# EAGLE design AmbaSat-01-SHT3x-DIS (EAGLE 9.5.1)
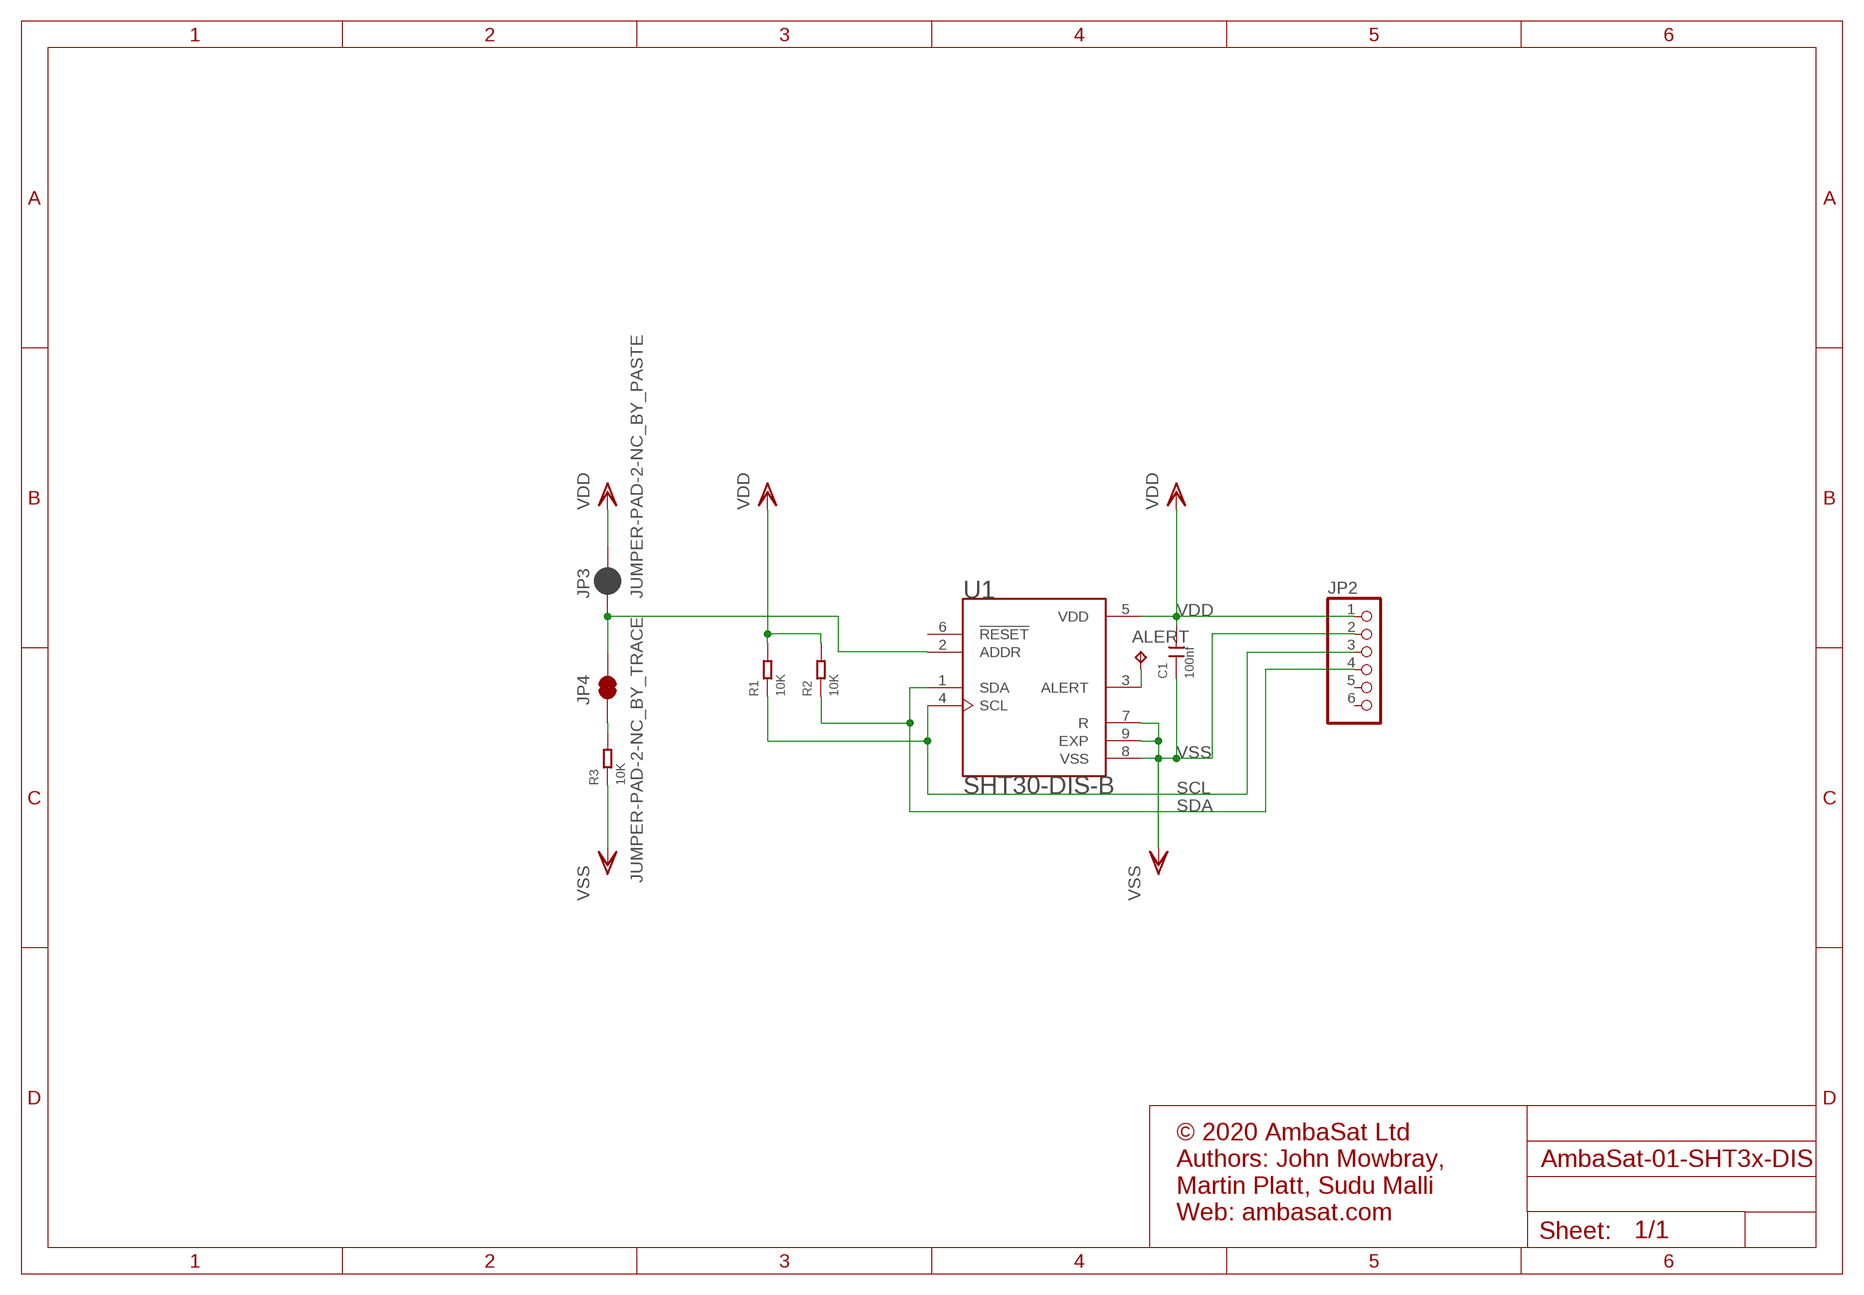
[diagram p0: schematic, sheet 1]

## Parts
ALERT  TPTP06R  [TP06R]
C1  100nf  CERAMIC-100NF-50V-10%-X7R(0603)  [C0603]
JP2  HEADER-1X6  [1X06_OVAL]
JP3  JUMPER-PAD-2-NC_BY_PASTE  [PAD-JUMPER-2-NC_BY_PASTE_YES_SILK]
JP4  JUMPER-PAD-2-NC_BY_TRACE  [PAD-JUMPER-2-NC_BY_TRACE_YES_SILK]
R1  10K  SMD-RES-10K-1%-1/10W(0603)  [R0603]
R2  10K  SMD-RES-10K-1%-1/10W(0603)  [R0603]
R3  10K  SMD-RES-10K-1%-1/10W(0603)  [R0603]
U1  SHT30-DIS-B  [DFN250X250X100-9N]

## Nets
N$1: JP3.1 JP4.2 U1.2(ADDR)
N$2: ALERT.TP U1.3(ALERT)
N$3: JP4.1 R3.2
SCL: JP2.3 R1.1 U1.4(SCL)
SDA: JP2.4 R2.1 U1.1(SDA)
VDD: C1.2 JP2.1 JP3.2 R1.2 R2.2 U1.5(VDD)
VSS: C1.1 JP2.2 R3.1 U1.7(R) U1.8(VSS) U1.9(EXP)
Unconnected: JP2.5 JP2.6 U1.6(!RESET)

## Notes on the sheet
- © 2020 AmbaSat Ltd
  Authors: John Mowbray, 
  Martin Platt, Sudu Malli
  Web: ambasat.com

## Library data of the parts
ALERT = testpad:TP: Test pad
C1 = Seeed-Capacitor:CERAMIC-100NF-50V-10%-X7R(0603): 302010138; MPN: CC0603KRX7R9BB104
JP2 = microbuilder:HEADER-1X6: PIN HEADER
JP3 = SparkFun-Passives:JUMPER-PAD-2-NC_BY_PASTE
JP4 = SparkFun-Passives:JUMPER-PAD-2-NC_BY_TRACE
R1-R3 = Seeed-Resistor:SMD-RES-10K-1%-1/10W(0603): 301010299; MPN: RC0603FR-0710KL
U1 = SHT30-DIS-B:SHT30-DIS-B: SHT3x Series 5.5 V ±3 %RH 0 to 100% Temperature and Humidity Sensor - DFN-8; AVAILABILITY: Unavailable; DESCRIPTION: SHT3x Series 5.5 V ±3 %RH 0 to 100% Temperature and Humidity Sensor - DFN-8; MF: Sensirion AG; MP: SHT30-DIS-B; PACKAGE: DFN-8 Sensirion; PRICE: None

## Board
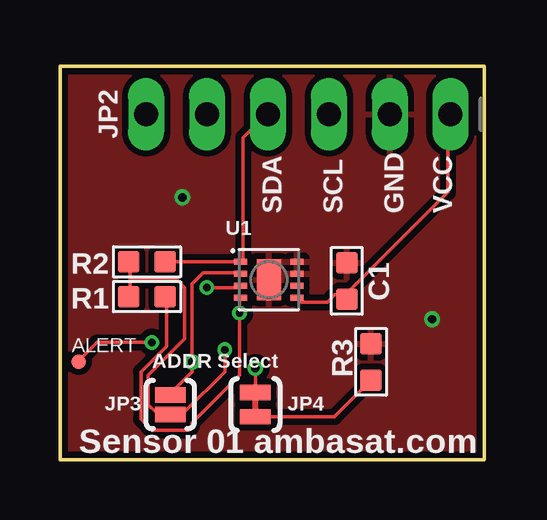
[diagram p1: board, top side]
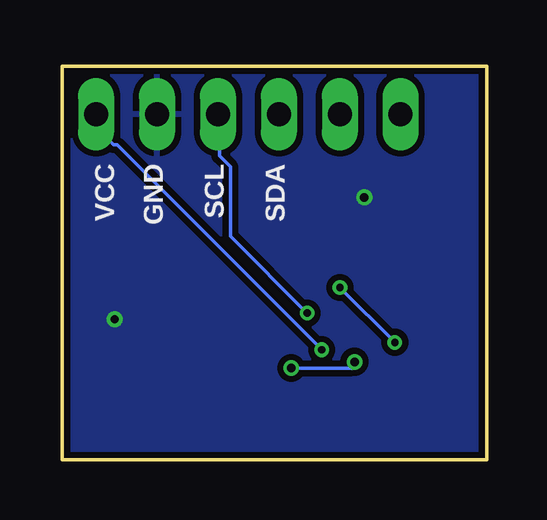
[diagram p2: board, bottom side, seen from below]

Size 17.7 x 16.4 mm. Coordinates in mm from the lower left corner, seen from the top.
Outline: 0,16.4 17.7,16.4 17.7,0 0,0 0,16.4
Copper layers (1*16): Top 0.035mm / dielectric 1.5mm / Bottom 0.035mm
Design rules "SeeedStudio_2layer_DRU_no_angle_20140221": minimum track width 6mil, minimum drill 12mil, track to track 6mil, track to pad 6mil, pad to pad 6mil, via to via 6mil, smd to smd 0mil, copper to edge 10mil, drill to drill 10mil, minimum pad ring 10mil, minimum via ring 6mil, stop-mask expansion 2mil, vias tented up to drill 100mil, thermal gap 10mil

### Footprints (pad centres in the part's own frame; a part is rotated, then mirrored left to right if it is on the bottom)
TP06R = smd 0.6 x 0.6: TP 0,0
C0603 = smd 0.889 x 0.889: 1 0,0.762; 2 0,-0.762
1X06_OVAL = drill 1 long: 1 -6.35,0; 2 -3.81,0; 3 -1.27,0; 4 1.27,0; 5 3.81,0; 6 6.35,0
PAD-JUMPER-2-NC_BY_PASTE_YES_SILK = smd 0.635 x 1.27: 1 -0.401,0; 2 0.413,0
PAD-JUMPER-2-NC_BY_TRACE_YES_SILK = smd 0.635 x 1.27: 1 -0.508,0; 2 0.508,0
R0603 = smd 0.889 x 0.889: 1 0,0.762; 2 0,-0.762
DFN250X250X100-9N = smd 0.55 x 0.25: 1 -1.175,0.75; 2 -1.175,0.25; 3 -1.175,-0.25; 4 -1.175,-0.75; 5 1.175,-0.75; 6 1.175,-0.25; 7 1.175,0.25; 8 1.175,0.75 | smd 1 x 1.7: 9 0,0

### Placement (x,y rotation side)
ALERT  0.78,4.08 0 top
C1  11.96,7.46 0 top
JP2  9.94,14.4 180 top
JP3  4.59,2.3 270 top
JP4  8.15,2.3 90 top
R1  3.63,6.8 270 top
R2  3.63,8.25 270 top
R3  12.98,4.08 0 top
U1  8.71,7.51 0 top

### Tracks (layer width: path | path; a pad name or v marks a point on that pad's centre or on a via)
N$1  (via drill 0.35)
  Top 0.152: U1.2 7.49,7.79 5.97,7.79 5.51,7.33 v5.51,4.08 5.51,3.68 4.59,2.76 JP3.1 | JP4.2 v8.15,3.83
  Bottom 0.152: v8.15,3.83 5.61,3.83 5.61,3.98 v5.51,4.08
N$2  (via drill 0.3)
  Top 0.152: v6.12,7.18 7.49,7.18 U1.3 | v3.83,4.9 1.55,4.9 0.78,4.13 ALERT.TP
  Bottom 0.152: v3.83,4.9 v6.12,7.18
N$3
  Top 0.152: JP4.1 11.45,1.8 R3.2
SCL  (via drill 0.3)
  Top 0.152: U1.4 7.49,6.72 v7.49,6.11 7.49,3.52 5.51,1.54 5.51,1.39 5.36,1.24 3.83,1.24 3.38,1.69 3.38,3.68 4.44,4.74 4.44,6.72 R1.1
  Bottom 0.152: v7.49,6.11 10.69,9.31 10.69,12.21 11.15,12.67 11.15,14.34 JP2.3
SDA
  Top 0.152: R2.1 7.49,8.25 U1.1 7.64,8.25 7.64,13.43 8.56,14.34 JP2.4
VDD  (via drill 0.3)
  Top 0.152: 2.92,7.49 2.92,8.25 R2.2 | 2.92,7.49 2.92,6.88 R1.2 | 4.59,2 3.98,2 3.68,2.3 3.68,3.52 5.2,5.05 5.2,7.18 4.9,7.49 2.92,7.49 | U1.5 9.93,6.72 10.08,6.57 11.15,6.57 11.45,6.88 11.91,6.88 C1.2 12.06,7.03 16.18,11.14 16.18,14.34 JP2.1 | 4.59,2 5.2,2 6.88,3.68 v6.88,4.59 | 4.59,2 JP3.2
  Bottom 0.152: v6.88,4.59 15.41,13.12 15.57,13.12 16.18,13.73 16.18,14.34 JP2.1
VSS  (via drill 0.35)
  other vias: 5.1,10.94 15.52,5.86
  pour Top (isolate 0.254): 0,16.4 0,0 17.7,0 17.7,16.4
  pour Bottom (isolate 0.254): 0,16.4 0,0 17.7,0 17.7,16.4

### Text on the board
tPlace: SDA | SCL | GND | VCC | ADDR Select | Sensor 01 ambasat.com
bPlace: SDA | SCL | GND | VCC